# Altium project RF_Filter_100MHz.PrjPcb
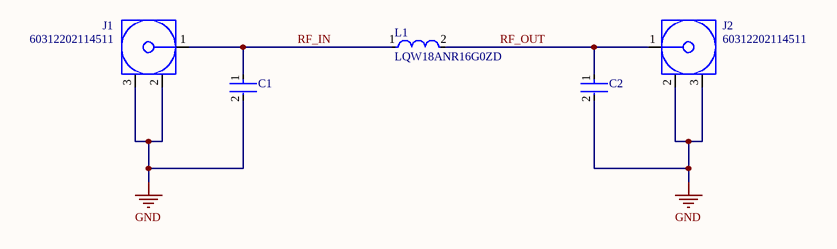
[diagram p0: RF_Filter.SchDoc]
1 sheet, 5 parts. Net scope: global (net labels, ports and power ports of the same name join across sheets).
Board file: RF_Filter.PcbDoc

## Sheet RF_Filter.SchDoc
size A; SheetNumber: 1; SheetTotal: 1

### Parts
C1  CC0603JRNPO9BN330  [FP-CC0603-0_9-IPC_C]  (value not drawn)
C2  CC0603JRNPO9BN330  [FP-CC0603-0_9-IPC_C]  (value not drawn)
J1  60312202114511  [60312202114511]
J2  60312202114511  [60312202114511]
L1  LQW18ANR16G0ZD  [FP-LQW18AN_00-MFG]

### Nets
GND: C1.2 C2.2 J1.2(GND) J1.3(GND) J2.2(GND) J2.3(GND)
RF_IN: C1.1 J1.1(Signal) L1.1
RF_OUT: C2.1 J2.1(Signal) L1.2

### Library data of the parts
C1 C2 = CMP-2000-06072-2: CAP CER 33PF 50V C0G/NPO 0603; Tolerance: 5%; Temperature Coefficient: 30ppm/°C; Dielectric: C0G; Insulation Resistance: 100GR; Dielectric Material: Ceramic; Voltage Rating (DC): 50V; Capacitance: 33pF; Voltage: 50V; Resistor Type: Ceramic; Lead Free: Lead Free; Mount: Surface Mount; Case Code (Imperial): 0603; Min Operating Temperature: -55°C; Package Quantity: 1; Case Code (Metric): 1608; Radiation Hardening: No; Packaging: Tape and Reel; Length: 1.6mm; Width: 0.031inch; Termination: SMD/SMT; Max Operating Temperature: 125°C; Series: CC; Case/Package: 0603; RoHS Compliant: Yes; Number of Pins: 2; REACH SVHC: No SVHC; Thickness: 0.035inch; Depth: 0.8mm; Voltage Rating: 50V; Height: 0.8mm
J1 J2 = CMP-03913-97004430-2: Rf Coax Conn, Sma Jack, 50 Ohm, Pcb Rohs Compliant: Yes; Insulation Resistance: 5GΩ; Insertion Loss (dB): 0.14dB; Impedance: 50Ω; Insulation Material: PTFE; Connector Type: SMA; Orientation: Straight; Min Operating Temperature: -65°C; Max Operating Temperature: 165°C
L1 = CMP-06042-014901-1: Wire Wound RF Inductor for Automotive 160nH ±2% 150mA 2.1Ω 0603 (1608)